# EAGLE design predajnik (EAGLE 7.5.0)
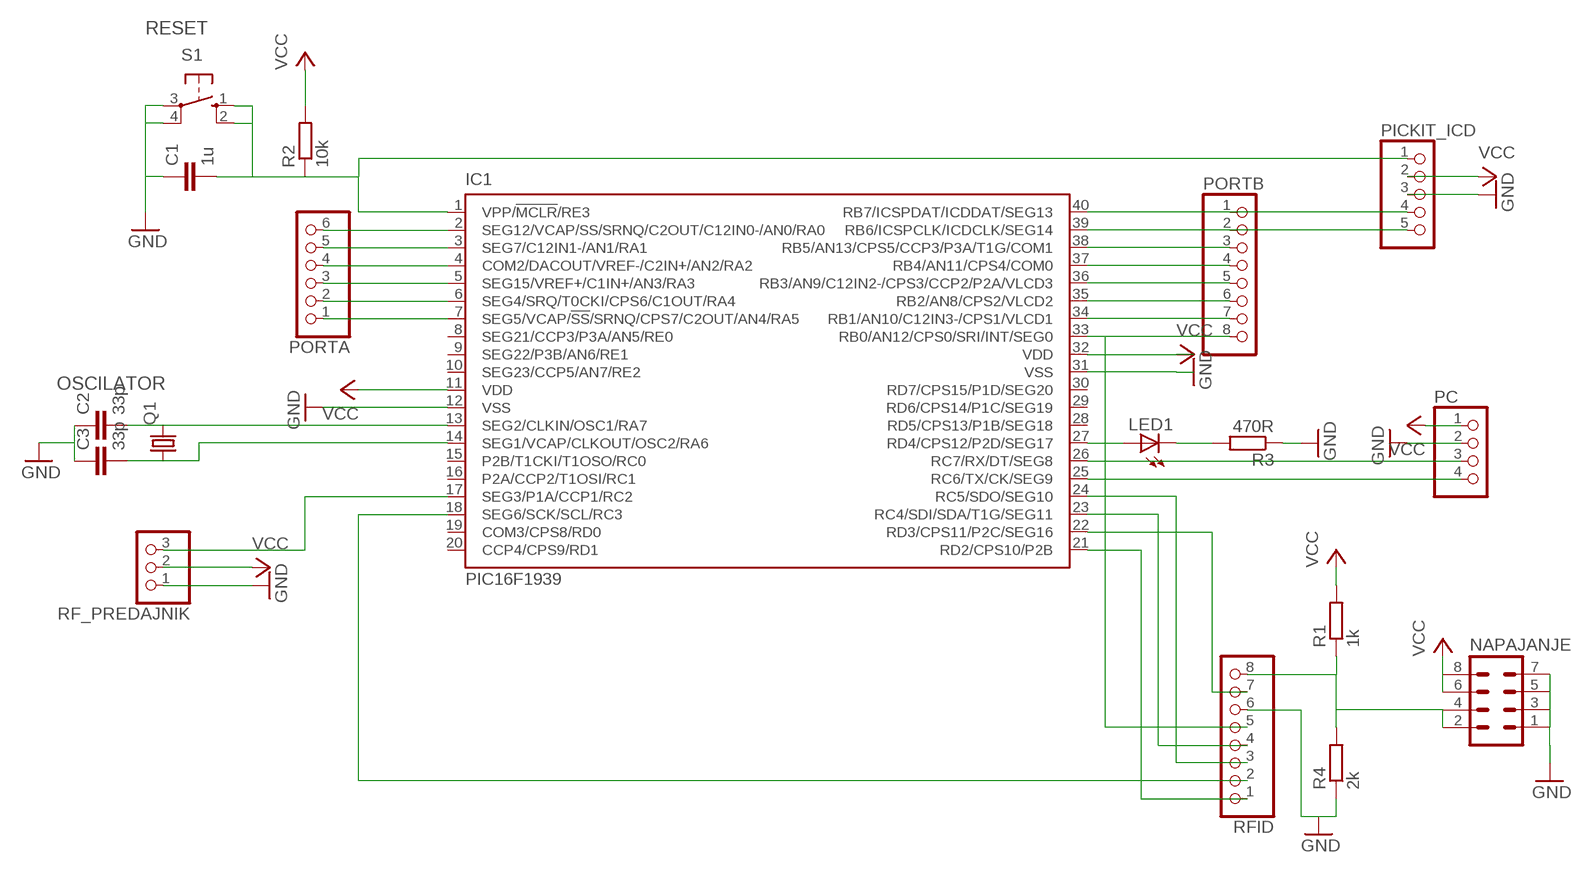
[diagram p0: schematic, sheet 1]

## Parts
C1  1u  C-EU050-024X044  [C050-024X044]
C2  33p  C-EU025-024X044  [C025-024X044]
C3  33p  C-EU025-024X044  [C025-024X044]
IC1  PIC16F1939  PIC16F193  [DIL40]
LED1  LED5MM  [LED5MM]
NAPAJANJE  MA04-2  [MA04-2]
PC  PINHD-1X4  [1X04]
PICKIT_ICD  PINHD-1X5  [1X05]
PORTA  PINHD-1X6  [1X06]
PORTB  PINHD-1X8  [1X08]
Q1  CRYSTALHC49S  [HC49/S]
R1  1k  R-EU_0207/10  [0207/10]
R2  10k  R-EU_0207/10  [0207/10]
R3  470R  R-EU_0207/10  [0207/10]
R4  2k  R-EU_0207/10  [0207/10]
RF_PREDAJNIK  PINHD-1X3  [1X03]
RFID  PINHD-1X8  [1X08]
S1  10-XX  [B3F-10XX]

## Nets
GND: C1.1 C2.1 C3.1 IC1.12(VSS) IC1.31(VSS) NAPAJANJE.1 NAPAJANJE.3 NAPAJANJE.5 NAPAJANJE.7 PC.2 PICKIT_ICD.3 R3.1 R4.1 RF_PREDAJNIK.1 RFID.6 S1.3(P) S1.4(P1)
N$1: IC1.22(RD3/CPS11/P2C/SEG16) RFID.7
N$2: IC1.17(SEG3/P1A/CCP1/RC2) RF_PREDAJNIK.3
N$3: C1.2 IC1.1(VPP/!MCLR!/RE3) PICKIT_ICD.1 R2.1 S1.1(S) S1.2(S1)
N$4: C3.2 IC1.14(SEG1/VCAP/CLKOUT/OSC2/RA6) Q1.1
N$5: C2.2 IC1.13(SEG2/CLKIN/OSC1/RA7) Q1.2
N$6: IC1.40(RB7/ICSPDAT/ICDDAT/SEG13) PICKIT_ICD.4 PORTB.1
N$7: IC1.39(RB6/ICSPCLK/ICDCLK/SEG14) PICKIT_ICD.5 PORTB.2
N$8: IC1.18(SEG6/SCK/SCL/RC3) RFID.2
N$9: IC1.24(RC5/SDO/SEG10) RFID.3
N$10: IC1.23(RC4/SDI/SDA/T1G/SEG11) RFID.4
N$11: IC1.33(RB0/AN12/CPS0/SRI/INT/SEG0) PORTB.8 RFID.5
N$13: IC1.21(RD2/CPS10/P2B) RFID.1
N$14: IC1.27(RD4/CPS12/P2D/SEG17) LED1.A
N$15: IC1.38(RB5/AN13/CPS5/CCP3/P3A/T1G/COM1) PORTB.3
N$16: IC1.7(SEG5/VCAP/!SS!/SRNQ/CPS7/C2OUT/AN4/RA5) PORTA.1
N$17: IC1.6(SEG4/SRQ/T0CKI/CPS6/C1OUT/RA4) PORTA.2
N$18: IC1.5(SEG15/VREF+/C1IN+/AN3/RA3) PORTA.3
N$19: IC1.4(COM2/DACOUT/VREF-/C2IN+/AN2/RA2) PORTA.4
N$20: IC1.3(SEG7/C12IN1-/AN1/RA1) PORTA.5
N$21: IC1.2(SEG12/VCAP/SS/SRNQ/C2OUT/C12IN0-/AN0/RA0) PORTA.6
N$22: IC1.37(RB4/AN11/CPS4/COM0) PORTB.4
N$23: IC1.36(RB3/AN9/C12IN2-/CPS3/CCP2/P2A/VLCD3) PORTB.5
N$24: IC1.35(RB2/AN8/CPS2/VLCD2) PORTB.6
N$25: IC1.34(RB1/AN10/C12IN3-/CPS1/VLCD1) PORTB.7
N$26: IC1.25(RC6/TX/CK/SEG9) PC.4
N$27: IC1.26(RC7/RX/DT/SEG8) PC.3
N$28: LED1.K(C) R3.2
N$45: NAPAJANJE.2 NAPAJANJE.4 R1.1 R4.2 RFID.8
VCC: IC1.11(VDD) IC1.32(VDD) NAPAJANJE.6 NAPAJANJE.8 PC.1 PICKIT_ICD.2 R1.2 R2.2 RF_PREDAJNIK.2
Unconnected: IC1.8(SEG21/CCP3/P3A/AN5/RE0) IC1.9(SEG22/P3B/AN6/RE1) IC1.10(SEG23/CCP5/AN7/RE2) IC1.15(P2B/T1CKI/T1OSO/RC0) IC1.16(P2A/CCP2/T1OSI/RC1) IC1.19(COM3/CPS8/RD0) IC1.20(CCP4/CPS9/RD1) IC1.28(RD5/CPS13/P1B/SEG18) IC1.29(RD6/CPS14/P1C/SEG19) IC1.30(RD7/CPS15/P1D/SEG20)

## Notes on the sheet
- RESET
- OSCILATOR

## Library data of the parts
C1-C3 = rcl:C-EU: CAPACITOR, European symbol
IC1 = microchip:PIC16F193*?: Flash-Based, 8-Bit CMOS Microcontrollers wtih LCD Driver and nanoWatt XLP Technology Auto generated by make-symbol-device-package-bsdl.ulp Rev. 33 Source: http://ww1.microchip.com/downloads/en/DeviceDoc/41364D.pdf
LED1 = led:LED: LED OSRAM: - CHIPLED LG R971, LG N971, LY N971, LG Q971, LY Q971, LO R971, LY R971 LH N974, LH R974 LS Q976, LO Q976, LY Q976 LO Q996 - Hyper CHIPLED LW Q18S LB Q993, LB Q99A, LB R99A - SideLED LS A670, LO A670, LY A670, LG A670, LP A670 LB A673, LV A673, LT A673, LW A673 LH A674 LY A675 LS A676, LA A676, LO A676, LY A676, LW A676 LS A679, LY A679, LG A679 - Hyper Micro SIDELED® LS Y876, LA Y876, LO Y876, LY Y876 LT Y87S - SmartLED LW L88C, LW L88S LB L89C, LB L89S, LG L890 LS L89K, LO L89K, LY L89K LS L896, LA L896, LO L896, LY L896 - TOPLED LS T670, LO T670, LY T670, LG T670, LP T670 LSG T670, LSP T670, LSY T670, LOP T670, LYG T670 LG T671, LOG T671, LSG T671 LB T673, LV T673, LT T673, LW T673 LH T674 LS T676, LA T676, LO T676, LY T676, LB T676, LH T676, LSB T676, LW T676 LB T67C, LV T67C, LT T67C, LS T67K, LO T67K, LY T67K, LW E67C LS E67B, LA E67B, LO E67B, LY E67B, LB E67C, LV E67C, LT E67C LW T67C LS T679, LY T679, LG T679 LS T770, LO T770, LY T770, LG T770, LP T770 LB T773, LV T773, LT T773, LW T773 LH T774 LS E675, LA E675, LY E675, LS T675 LS T776, LA T776, LO T776, LY T776, LB T776 LHGB T686 LT T68C, LB T68C - Hyper Mini TOPLED® LB M676 - Mini TOPLED Santana® LG M470 LS M47K, LO M47K, LY M47K Source: http://www.osram.convergy.de LUXEON: - LUMILED® LXK2-PW12-R00, LXK2-PW12-S00, LXK2-PW14-U00, LXK2-PW14-V00 LXK2-PM12-R00, LXK2-PM12-S00, LXK2-PM14-U00 LXK2-PE12-Q00, LXK2-PE12-R00, LXK2-PE12-S00, LXK2-PE14-T00, LXK2-PE14-U00 LXK2-PB12-K00, LXK2-PB12-L00, LXK2-PB12-M00, LXK2-PB14-N00, LXK2-PB14-P00, LXK2-PB14-Q00 LXK2-PR12-L00, LXK2-PR12-M00, LXK2-PR14-Q00, LXK2-PR14-R00 LXK2-PD12-Q00, LXK2-PD12-R00, LXK2-PD12-S00 LXK2-PH12-R00, LXK2-PH12-S00 LXK2-PL12-P00, LXK2-PL12-Q00, LXK2-PL12-R00 Source: www.luxeon.com KINGBRIGHT: KA-3528ASYC Source: www.kingbright.com
NAPAJANJE = con-lstb:MA04-2: PIN HEADER; OC_FARNELL: unknown; OC_NEWARK: unknown
PC = pinhead:PINHD-1X4: PIN HEADER
PICKIT_ICD = pinhead:PINHD-1X5: PIN HEADER
PORTA = pinhead:PINHD-1X6: PIN HEADER
PORTB RFID = pinhead:PINHD-1X8: PIN HEADER
Q1 = crystal:CRYSTAL: CRYSTAL; OC_FARNELL: 1667008; OC_NEWARK: unknown
R1-R4 = resistor:R-EU_: RESISTOR, European symbol
RF_PREDAJNIK = pinhead:PINHD-1X3: PIN HEADER
S1 = switch-omron:10-XX: OMRON SWITCH; MPN: B3F-1000; OC_FARNELL: 176432; OC_NEWARK: 36M3542

## Board
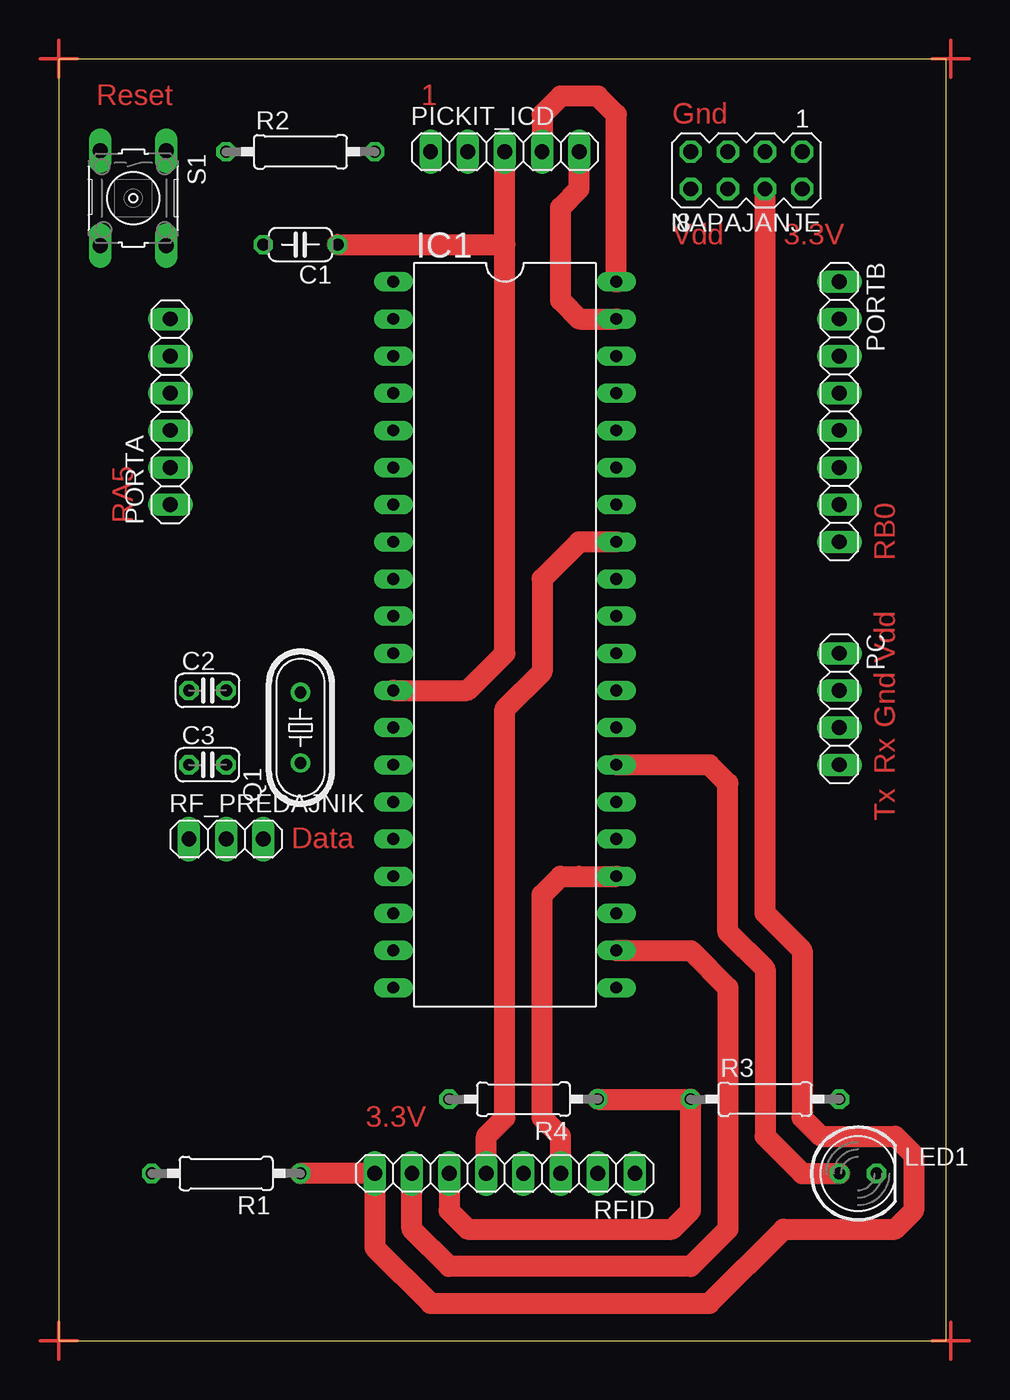
[diagram p1: board, top side]
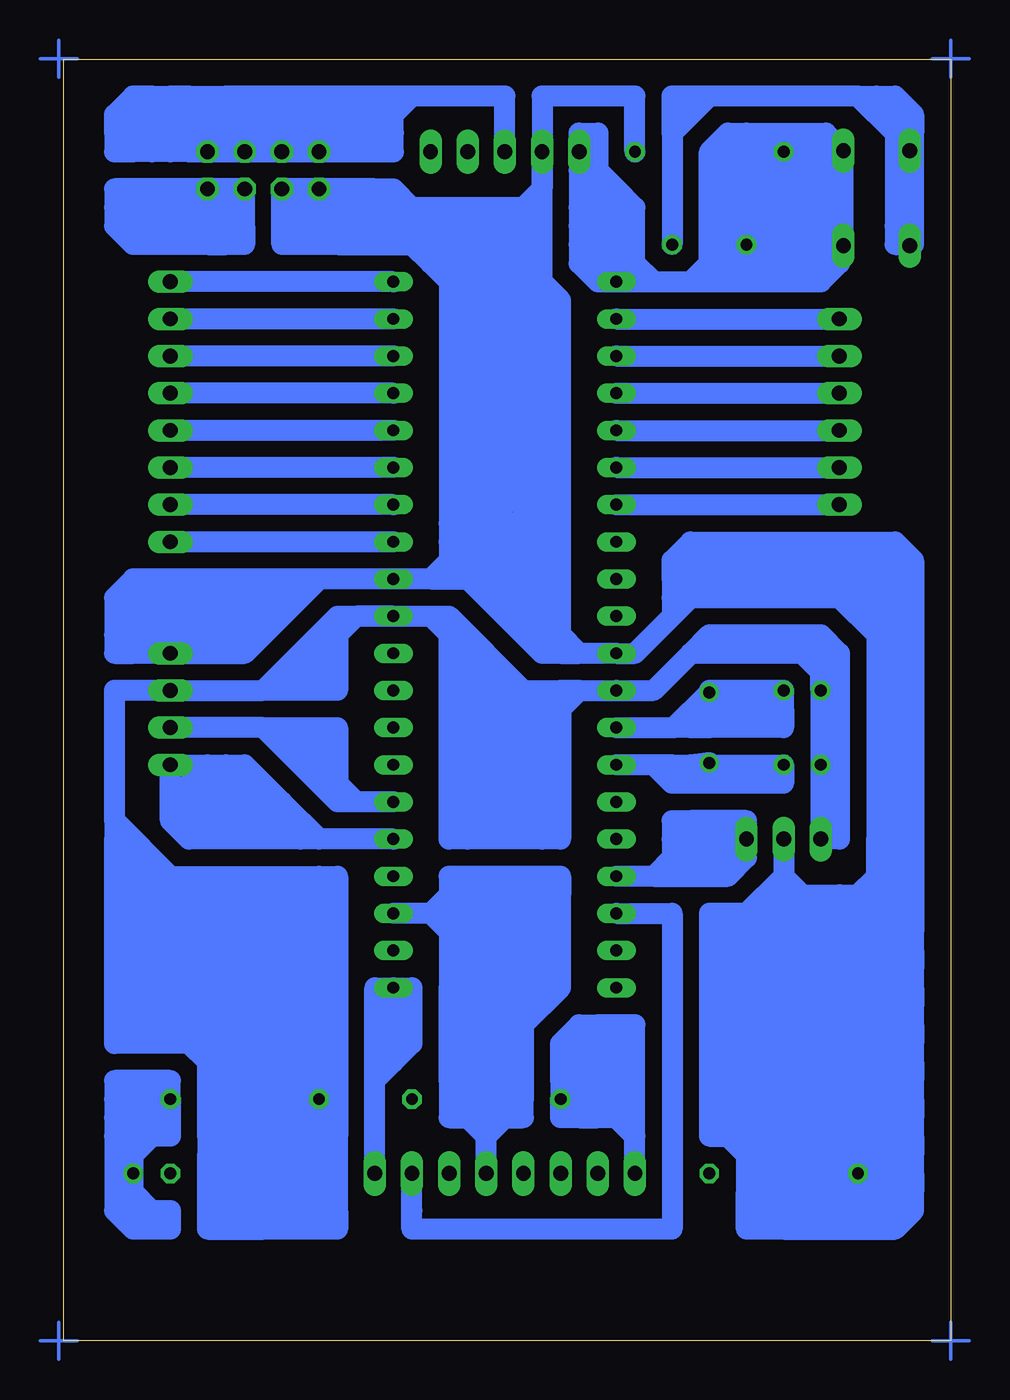
[diagram p2: board, bottom side, seen from below]

Size 60.63 x 87.62 mm. Coordinates in mm from the lower left corner, seen from the top.
Outline: 0,0 60.63,0 60.63,87.62 0,87.62 0,0
Copper layers (1*16): Top 0.035mm / dielectric 1.5mm / Bottom 0.035mm
Design rules "default": minimum track width 10mil, minimum drill 24mil, track to track 8mil, track to pad 8mil, pad to pad 8mil, via to via 8mil, smd to smd 8mil, copper to edge 40mil, drill to drill 8mil, minimum pad ring 10mil, minimum via ring 8mil, stop-mask expansion 4mil, vias tented up to drill 0mil, thermal gap 10mil

### Footprints (pad centres in the part's own frame; a part is rotated, then mirrored left to right if it is on the bottom)
C050-024X044 = drill 0.813 octagon: 1 -2.54,0; 2 2.54,0
C025-024X044 = drill 0.813 octagon: 1 -1.27,0; 2 1.27,0
DIL40 = drill 0.813 long: 1 -24.13,-7.62; 2 -21.59,-7.62; 3 -19.05,-7.62; 4 -16.51,-7.62; 5 -13.97,-7.62; 6 -11.43,-7.62; 7 -8.89,-7.62; 8 -6.35,-7.62; 9 -3.81,-7.62; 10 -1.27,-7.62; 11 1.27,-7.62; 12 3.81,-7.62; 13 6.35,-7.62; 14 8.89,-7.62; 15 11.43,-7.62; 16 13.97,-7.62; 17 16.51,-7.62; 18 19.05,-7.62; 19 21.59,-7.62; 20 24.13,-7.62; 21 24.13,7.62; 22 21.59,7.62; 23 19.05,7.62; 24 16.51,7.62; 25 13.97,7.62; 26 11.43,7.62; 27 8.89,7.62; 28 6.35,7.62; 29 3.81,7.62; 30 1.27,7.62; 31 -1.27,7.62; 32 -3.81,7.62; 33 -6.35,7.62; 34 -8.89,7.62; 35 -11.43,7.62; 36 -13.97,7.62; 37 -16.51,7.62; 38 -19.05,7.62; 39 -21.59,7.62; 40 -24.13,7.62
LED5MM = drill 0.813 octagon: A -1.27,0; K 1.27,0
MA04-2 = drill 1.016 octagon: 1 -3.81,-1.27; 2 -3.81,1.27; 3 -1.27,-1.27; 4 -1.27,1.27; 5 1.27,-1.27; 6 1.27,1.27; 7 3.81,-1.27; 8 3.81,1.27
1X04 = drill 1.016 long: 1 -3.81,0; 2 -1.27,0; 3 1.27,0; 4 3.81,0
1X05 = drill 1.016 long: 1 -5.08,0; 2 -2.54,0; 3 0,0; 4 2.54,0; 5 5.08,0
1X06 = drill 1.016 long: 1 -6.35,0; 2 -3.81,0; 3 -1.27,0; 4 1.27,0; 5 3.81,0; 6 6.35,0
1X08 = drill 1.016 long: 1 -8.89,0; 2 -6.35,0; 3 -3.81,0; 4 -1.27,0; 5 1.27,0; 6 3.81,0; 7 6.35,0; 8 8.89,0
HC49/S = drill 0.813: 1 -2.413,0; 2 2.413,0
0207/10 = drill 0.813 octagon: 1 -5.08,0; 2 5.08,0
1X03 = drill 1.016 long: 1 -2.54,0; 2 0,0; 3 2.54,0
B3F-10XX = drill 1.016 long: 1 -3.251,2.261; 2 3.251,2.261; 3 -3.251,-2.261; 4 3.251,-2.261

### Placement (x,y rotation side)
C1  16.51,74.93 180 top
C2  10.16,44.45 0 top
C3  10.16,39.37 0 top
IC1  30.48,48.26 270 top
LED1  54.61,11.43 0 top
NAPAJANJE  46.99,80.01 180 top
PC  53.34,43.18 270 top
PICKIT_ICD  30.48,81.28 0 top
PORTA  7.62,63.5 90 top
PORTB  53.34,63.5 270 top
Q1  16.51,41.91 90 top
R1  11.43,11.43 180 top
R2  16.51,81.28 0 top
R3  48.26,16.51 0 top
R4  31.75,16.51 180 top
RF_PREDAJNIK  11.43,34.29 0 top
RFID  30.48,11.43 180 top
S1  5.08,78.11 270 top

### Tracks (layer width: path | path; a pad name or v marks a point on that pad's centre or on a via)
GND
  Top 1.422: IC1.12 27.94,44.45 30.48,46.99 30.48,74.93 | 30.48,74.93 PICKIT_ICD.3 | RFID.6 26.67,8.89 27.94,7.62 41.91,7.62 43.18,8.89 R3.1 R4.1 | C1.1 30.48,74.93
  Bottom 1.422: S1.3 S1.4 2.9,74.93 | 2.9,74.93 2.9,75.29 3.81,76.2 | 6.35,85.09 16.51,85.09 | 2.54,74.93 2.54,81.28 | 2.54,81.28 3.81,82.55 | 3.81,82.55 6.35,85.09 | 16.51,85.09 19.05,82.55 | 19.05,82.55 C1.1 | PICKIT_ICD.3 30.48,85.09 36.83,85.09 | 38.1,85.09 41.91,85.09 | 43.18,83.82 43.18,85.09 | 43.18,85.09 48.26,85.09 | 48.26,85.09 49.53,85.09 | 49.53,85.09 50.8,83.82 | NAPAJANJE.1 49.53,81.28 | NAPAJANJE.5 NAPAJANJE.7 | NAPAJANJE.7 44.45,82.55 | 44.45,82.55 44.45,83.82 | 44.45,83.82 43.18,83.82 | 44.45,83.82 49.53,83.82 49.53,82.55 | 49.53,82.55 49.53,81.28 | 49.53,81.28 NAPAJANJE.3 | NAPAJANJE.5 44.45,82.55 | 44.45,82.55 49.53,82.55 | 49.53,82.55 NAPAJANJE.3 | NAPAJANJE.3 NAPAJANJE.5 | 43.18,83.82 43.18,82.55 | 43.18,82.55 NAPAJANJE.7 | NAPAJANJE.7 39.37,81.28 | 38.1,83.82 36.83,85.09 | 36.83,85.09 38.1,85.09 | 38.1,85.09 39.37,83.82 | 39.37,83.82 39.37,82.55 43.18,82.55 | 43.18,82.55 41.91,83.82 | 41.91,83.82 39.37,83.82 | 41.91,83.82 43.18,83.82 | 43.18,83.82 41.91,85.09 | 41.91,85.09 43.18,85.09 | R3.1 44.45,17.78 | 49.53,17.78 50.8,19.05 | IC1.31 40.64,49.53 41.91,48.26 | 43.18,44.45 44.45,44.45 | 43.18,44.45 41.91,45.72 41.91,46.99 | 41.91,46.99 44.45,44.45 | 44.45,44.45 45.72,44.45 | 45.72,44.45 46.99,44.45 | 46.99,44.45 45.72,45.72 | 45.72,45.72 44.45,46.99 | 41.91,48.26 41.91,46.99 | 41.91,46.99 43.18,46.99 | 44.45,45.72 45.72,45.72 | 45.72,45.72 45.72,44.45 | 43.18,46.99 41.91,48.26 | 41.91,48.26 43.18,48.26 | 43.18,48.26 41.91,49.53 | IC1.31 35.56,49.53 | 35.56,49.53 34.29,49.53 29.21,44.45 | 41.91,49.53 41.91,44.45 43.18,44.45 | 44.45,44.45 44.45,45.72 | 45.72,44.45 43.18,46.99 | 57.15,35.56 53.34,31.75 | 53.34,31.75 43.18,31.75 | 43.18,31.75 41.91,31.75 41.91,30.48
  Bottom 1.422: 41.91,19.05 R3.1 | 41.91,17.78 41.91,13.97 | 43.18,7.62 41.91,7.62 41.91,8.89 | 43.18,7.62 46.99,7.62 | 46.99,7.62 48.26,8.89 | 50.8,15.24 50.8,16.51 | 50.8,16.51 50.8,19.05 | 50.8,19.05 52.07,20.32 57.15,20.32 | 57.15,20.32 57.15,21.59 | 57.15,21.59 57.15,34.29 | 57.15,35.56 57.15,34.29 | 55.88,33.02 54.61,31.75 | 54.61,31.75 53.34,31.75 | 43.18,31.75 41.91,30.48 | 41.91,30.48 41.91,17.78 | 41.91,17.78 R3.1 | R3.1 43.18,15.24 | 43.18,15.24 43.18,12.7 | 46.99,8.89 48.26,8.89 | 48.26,11.43 46.99,12.7 | 46.99,11.43 46.99,10.16 | 44.45,16.51 44.45,17.78 | 44.45,17.78 45.72,17.78 | 45.72,17.78 44.45,16.51 | 44.45,16.51 44.45,13.97 | 44.45,13.97 44.45,11.43 | 45.72,10.16 45.72,12.7 | 45.72,16.51 45.72,17.78 | 48.26,17.78 49.53,17.78 | 49.53,17.78 50.8,16.51 | 50.8,16.51 49.53,16.51 | 49.53,16.51 46.99,16.51 | 46.99,16.51 45.72,16.51 | 45.72,16.51 45.72,15.24 | 45.72,15.24 45.72,12.7 | 45.72,12.7 46.99,11.43 | 46.99,12.7 46.99,13.97 | 46.99,16.51 46.99,15.24 | 46.99,15.24 46.99,13.97 | 46.99,13.97 48.26,12.7 | 48.26,12.7 48.26,13.97 | 48.26,13.97 48.26,15.24 | 48.26,15.24 46.99,15.24 | 46.99,15.24 45.72,15.24 | 49.53,15.24 48.26,13.97 | 48.26,13.97 46.99,15.24 | 46.99,15.24 43.18,19.05 43.18,30.48 44.45,30.48 | 54.61,30.48 55.88,31.75 | 55.88,31.75 55.88,33.02 | 55.88,31.75 55.88,21.59 | 55.88,21.59 54.61,21.59 | 54.61,21.59 52.07,21.59 | 52.07,21.59 48.26,17.78 | 48.26,17.78 45.72,17.78 | 45.72,17.78 44.45,19.05 | 44.45,27.94 44.45,29.21 | 44.45,29.21 44.45,30.48 | 44.45,30.48 45.72,30.48 | 45.72,30.48 54.61,30.48 | 54.61,30.48 54.61,24.13 | 54.61,24.13 54.61,22.86 | 54.61,21.59 54.61,22.86 | 54.61,22.86 52.07,22.86 | 52.07,22.86 50.8,22.86 | 50.8,22.86 50.8,21.59 | 50.8,21.59 48.26,19.05 45.72,19.05
  Bottom 1.422: 45.72,26.67 45.72,29.21 | 45.72,29.21 46.99,29.21 | 46.99,29.21 48.26,29.21 | 52.07,29.21 53.34,29.21 | 53.34,29.21 53.34,27.94 | 53.34,27.94 53.34,24.13 50.8,24.13 | 50.8,24.13 50.8,22.86 | 50.8,22.86 49.53,21.59 | 49.53,21.59 48.26,20.32 46.99,20.32 | 46.99,20.32 45.72,19.05 | 45.72,19.05 45.72,26.67 | 45.72,26.67 46.99,27.94 | 46.99,27.94 46.99,25.4 | 46.99,25.4 46.99,22.86 | 46.99,22.86 46.99,20.32 | 46.99,20.32 48.26,21.59 48.26,26.67 | 48.26,27.94 48.26,29.21 | 52.07,29.21 53.34,27.94 | 53.34,27.94 52.07,27.94 | 52.07,27.94 50.8,27.94 | 50.8,27.94 49.53,27.94 | 49.53,27.94 48.26,27.94 | 48.26,27.94 48.26,26.67 | 48.26,26.67 49.53,27.94 | 49.53,27.94 49.53,26.67 | 49.53,21.59 49.53,26.67 | 49.53,26.67 50.8,27.94 | 50.8,27.94 50.8,26.67 | 50.8,24.13 50.8,26.67 | 50.8,26.67 52.07,27.94 | 52.07,27.94 52.07,24.13 | 52.07,22.86 52.07,24.13 | 52.07,24.13 46.99,29.21 | 46.99,29.21 46.99,27.94 | 46.99,25.4 44.45,27.94 | 44.45,27.94 44.45,19.05 | 44.45,19.05 R3.1 | 25.4,44.45 26.67,43.18 26.67,34.29 27.94,34.29 | 27.94,34.29 33.02,34.29 | 34.29,35.56 34.29,48.26 | 29.21,44.45 26.67,44.45 | 25.4,44.45 26.67,44.45 | 27.94,39.37 27.94,38.1 | 27.94,36.83 27.94,35.56 | 27.94,35.56 29.21,35.56 | 29.21,35.56 30.48,35.56 | 33.02,35.56 33.02,46.99 | 33.02,46.99 34.29,48.26 | 30.48,44.45 29.21,44.45 | 29.21,44.45 27.94,43.18 | 27.94,43.18 27.94,41.91 | 29.21,36.83 31.75,36.83 | 31.75,43.18 31.75,45.72 | 30.48,44.45 29.21,43.18 | 29.21,43.18 29.21,40.64 | 29.21,39.37 29.21,38.1 | 29.21,38.1 30.48,38.1 31.75,36.83 | 31.75,36.83 31.75,38.1 | 31.75,38.1 31.75,43.18 | 31.75,43.18 30.48,44.45 | 30.48,44.45 30.48,39.37 | 30.48,39.37 31.75,38.1 | 30.48,39.37 29.21,40.64 | 29.21,40.64 29.21,39.37
  Bottom 1.422: 29.21,39.37 33.02,35.56 | 33.02,35.56 30.48,35.56 | 30.48,35.56 29.21,36.83 | 29.21,38.1 27.94,39.37 | 27.94,39.37 27.94,41.91 | 27.94,41.91 29.21,43.18 | 31.75,45.72 33.02,46.99 | 29.21,43.18 27.94,43.18 | 27.94,43.18 26.67,44.45 | 25.4,44.45 IC1.12 20.32,44.45 17.78,46.99 | 33.02,34.29 34.29,34.29 34.29,35.56 | 34.29,35.56 33.02,34.29 | 27.94,35.56 27.94,34.29 | 27.94,34.29 29.21,35.56 | 29.21,35.56 29.21,36.83 | 27.94,38.1 27.94,36.83 | 27.94,36.83 29.21,35.56 | 29.21,36.83 29.21,38.1 | 38.1,82.55 38.1,81.28 39.37,81.28 | 38.1,82.55 39.37,81.28 | 38.1,82.55 38.1,83.82 | 38.1,83.82 39.37,83.82 | 29.21,36.83 27.94,38.1 | 27.94,38.1 29.21,38.1 | 3.81,82.55 3.81,74.93 2.9,74.93 | 6.35,85.09 5.08,85.09 | 5.08,85.09 3.81,85.09 | 3.81,85.09 2.54,83.82 2.54,82.55 | 2.54,81.28 2.54,82.55 | 2.54,82.55 3.81,83.82 | 5.08,85.09 3.81,83.82 | 3.81,85.09 3.81,83.82 | 43.18,8.89 44.45,10.16 | 44.45,10.16 45.72,10.16 | 45.72,10.16 46.99,10.16 | 46.99,10.16 46.99,8.89 | 46.99,11.43 46.99,12.7 | 48.26,15.24 49.53,15.24 | 49.53,15.24 50.8,13.97 | 50.8,13.97 50.8,15.24 | 50.8,15.24 49.53,16.51 | 49.53,16.51 49.53,20.32 46.99,22.86 | 46.99,22.86 50.8,22.86 | 52.07,22.86 50.8,21.59 | 50.8,21.59 52.07,21.59 | 52.07,21.59 54.61,24.13 | 54.61,24.13 52.07,24.13 | 46.99,29.21 45.72,30.48 | 45.72,30.48 44.45,29.21 | 44.45,29.21 45.72,29.21 | 48.26,29.21 52.07,29.21 | 53.34,29.21 54.61,30.48 | 54.61,30.48 54.61,31.75 | 55.88,33.02 57.15,34.29 | 57.15,35.56 57.15,44.45 PC.2 46.99,44.45 | 44.45,45.72 44.45,46.99 | 44.45,46.99 43.18,48.26 | 41.91,49.53 IC1.31 | 35.56,49.53 34.29,48.26 | 31.75,45.72 30.48,44.45 | 44.45,10.16 44.45,11.43 | 44.45,11.43 45.72,12.7 | 52.07,81.28 53.34,81.28 | 57.15,82.55 57.15,83.82 55.88,85.09
  Bottom 1.422: 54.61,85.09 53.34,85.09 | 52.07,85.09 49.53,85.09 | 48.26,85.09 50.8,82.55 | 50.8,82.55 50.8,83.82 | 50.8,83.82 52.07,85.09 | 52.07,81.28 NAPAJANJE.1 | NAPAJANJE.1 49.53,82.55 | 49.53,82.55 50.8,82.55 | 50.8,82.55 52.07,81.28 | 52.07,81.28 52.07,85.09 | 52.07,85.09 53.34,85.09 | 53.34,85.09 53.34,81.28 | 53.34,81.28 54.61,81.28 | 54.61,81.28 54.61,85.09 | 54.61,85.09 55.88,85.09 | 55.88,85.09 55.88,81.28 | 57.15,82.55 50.8,82.55 | 44.45,82.55 43.18,82.55 | 48.26,12.7 49.53,13.97 | 49.53,13.97 50.8,13.97 | 50.8,13.97 50.8,12.7 | 50.8,12.7 49.53,13.97 | 49.53,13.97 49.53,8.89 | 48.26,8.89 48.26,11.43 | 48.26,11.43 48.26,12.7 | 48.26,8.89 48.26,7.62 | 48.26,7.62 46.99,7.62 | 49.53,8.89 48.26,8.89 | 48.26,7.62 46.99,8.89 | 46.99,8.89 43.18,8.89 | 43.18,8.89 43.18,12.7 | 43.18,12.7 44.45,13.97 | 17.78,46.99 16.51,48.26 10.16,48.26 | C2.1 8.89,43.13 | 10.16,48.26 8.89,48.26 | 8.89,48.26 7.62,46.99 7.62,34.29 RF_PREDAJNIK.1 C3.1 C2.1 | C2.1 8.89,45.72 | 10.16,48.26 8.89,46.99 8.89,45.72 | 8.89,45.72 10.16,46.99 17.78,46.99 | 8.89,48.26 C2.1 | 50.8,7.62 50.8,12.7 | 50.8,7.62 48.26,7.62 | 48.26,7.62 49.53,8.89 | 50.8,7.62 49.53,8.89 | 57.15,82.55 57.15,81.28 55.88,81.28 | 54.61,81.28 55.88,81.28 | 57.15,21.59 55.88,21.59 | 57.15,20.32 55.88,21.59 | 43.18,7.62 41.91,8.89 | 41.91,8.89 41.91,13.97 | 41.91,13.97 43.18,15.24 | 16.51,85.09 17.78,85.09 | 17.78,85.09 19.05,85.09 19.05,83.82 | 19.05,82.55 19.05,83.82 | 17.78,85.09 19.05,83.82
N$1
  Top 1.422: IC1.22 43.18,26.67 45.72,24.13 45.72,7.62 43.18,5.08 26.67,5.08 24.13,7.62 RFID.7
N$2
  Bottom 1.422: 13.97,33.02 RF_PREDAJNIK.3 | RF_PREDAJNIK.3 13.97,35.56 17.78,35.56 | 17.78,35.56 19.05,34.29 | 19.05,34.29 RF_PREDAJNIK.3 | 20.32,31.75 19.05,31.75 | 19.05,31.75 15.24,31.75 13.97,33.02 | 19.05,33.02 13.97,33.02 | 19.05,31.75 19.05,33.02 | 19.05,34.29 19.05,35.56 17.78,35.56 | 19.05,34.29 19.05,33.02 | 19.05,33.02 20.32,31.75 | 20.32,31.75 IC1.17
N$3
  Bottom 1.422: 20.32,72.39 17.78,72.39 | 16.51,72.39 8.89,72.39 | 7.62,73.66 7.62,74.57 | 7.62,74.57 S1.2 S1.1 8.53,82.55 | C1.2 15.24,74.93 | 16.51,76.2 16.51,77.47 | 16.51,80.01 16.51,81.28 15.24,82.55 13.97,82.55 | 13.97,82.55 8.53,82.55 | 8.53,82.55 8.53,78.38 7.62,77.47 | 7.62,77.47 7.62,76.2 | 7.62,73.66 8.89,72.39 | 8.89,72.39 7.62,76.2 | 7.62,77.47 7.62,78.74 | 7.62,76.2 7.62,74.57 | 7.62,73.66 13.97,73.66 | 16.51,73.66 17.78,72.39 | 17.78,72.39 16.51,72.39 | 16.51,72.39 15.24,73.66 | 15.24,73.66 16.51,73.66 | 16.51,73.66 16.51,74.93 | 16.51,74.93 16.51,76.2 | 16.51,76.2 15.24,74.93 | 15.24,74.93 16.51,74.93 | 16.51,74.93 15.24,73.66 | 15.24,73.66 13.97,73.66 | 13.97,73.66 12.7,74.93 C1.2 | C1.2 8.89,74.93 8.89,76.2 | 8.89,76.2 7.62,77.47 | 7.62,77.47 15.24,77.47 15.24,76.2 11.43,76.2 | 11.43,76.2 8.89,76.2 | 8.89,76.2 8.89,78.74 10.16,78.74 | 13.97,78.74 15.24,78.74 | 15.24,78.74 16.51,77.47 | 16.51,77.47 16.51,80.01 | 16.51,80.01 15.24,81.28 | 15.24,81.28 15.24,80.01 | 15.24,78.74 15.24,80.01 | 15.24,80.01 13.97,81.28 | 13.97,80.01 13.97,78.74 | 13.97,78.74 12.7,78.74 | 12.7,78.74 10.16,78.74 | 10.16,78.74 8.89,80.01 8.89,81.28 | 12.7,81.28 13.97,81.28 | 13.97,81.28 13.97,80.01 | 13.97,80.01 10.16,80.01 8.89,81.28 | 8.89,81.28 R2.1 | R2.1 12.7,81.28 | 12.7,81.28 13.97,82.55 | 13.97,82.55 15.24,81.28 | 15.24,81.28 12.7,78.74 | 12.7,78.74 12.7,77.47 11.43,76.2 | 11.43,76.2 R2.1 | IC1.1 21.59,72.39 | 21.59,72.39 20.32,72.39 | 20.32,72.39 21.59,73.66 | 21.59,73.66 21.59,77.47 22.86,78.74 | 24.13,78.74 22.86,78.74 | 22.86,78.74 24.13,80.01 | 24.13,80.01 24.13,82.55 25.4,82.55 PICKIT_ICD.1 25.4,80.01 | 25.4,80.01 25.4,77.47 | 25.4,76.2 25.4,74.93 | 25.4,74.93 25.4,73.66 24.13,72.39 IC1.1
  Bottom 1.422: 21.59,72.39 21.59,73.66 | 21.59,73.66 22.86,74.93 | 22.86,74.93 IC1.1 | IC1.1 24.13,73.66 | 24.13,73.66 22.86,74.93 | 22.86,74.93 22.86,77.47 24.13,77.47 | 24.13,77.47 25.4,77.47 | 25.4,77.47 25.4,76.2 | 25.4,76.2 24.13,74.93 | 24.13,74.93 24.13,76.2 | 24.13,74.93 24.13,73.66 | 24.13,73.66 25.4,74.93 | 25.4,74.93 24.13,76.2 | 24.13,76.2 24.13,77.47 | 24.13,77.47 24.13,80.01 | 24.13,80.01 25.4,80.01
N$4
  Bottom 1.422: Q1.1 16.64,39.5 17.78,39.37 | 17.78,39.37 16.51,39.37 | 16.51,39.37 16.51,38.1 | 16.51,38.1 11.43,38.1 C3.2 16.51,39.37 | 16.51,38.1 17.78,38.1 | 17.78,38.1 17.78,39.37 | 20.32,39.37 IC1.14 | 17.78,38.1 19.05,38.1 | 19.05,38.1 20.32,39.37 | 17.78,39.37 19.05,38.1 | 19.05,38.1 19.05,39.37 | 19.05,39.37 20.32,39.37 | 19.05,39.37 17.78,39.37
N$5
  Bottom 1.422: 11.56,44.32 C2.2 | IC1.13 18.92,41.91 | 18.92,41.91 Q1.2 | Q1.2 16.51,43.18 | 16.51,43.18 17.78,41.91 | 17.78,41.91 18.92,41.91 | 17.78,41.91 16.51,41.91 | 11.43,43.18 C2.2 | C2.2 16.51,44.45 Q1.2 | 15.24,43.18 11.43,43.18 | 11.43,43.18 11.43,41.91 16.51,41.91 | 16.51,41.91 16.51,43.18 | 16.51,43.18 15.24,43.18 | 15.24,43.18 15.24,44.45 C2.2
N$6
  Top 1.422: IC1.40 38.1,83.82 36.83,85.09 34.29,85.09 33.02,83.82 PICKIT_ICD.4
  Bottom 1.422: IC1.40 PORTB.1
N$7
  Top 1.422: IC1.39 35.56,69.85 34.29,71.12 34.29,77.47 35.56,78.74 PICKIT_ICD.5
  Bottom 1.422: IC1.39 PORTB.2
N$8
  Bottom 1.422: 36.83,8.89 RFID.2 36.83,7.62 19.05,7.62 19.05,29.21 IC1.18
N$9
  Top 1.422: 35.56,31.75 IC1.24 34.29,31.75 33.02,30.48 33.02,15.24 34.29,13.97 RFID.3
N$10
  Bottom 1.422: 34.29,31.75 33.02,30.48 | RFID.4 31.75,13.97 | 31.75,13.97 30.48,15.24 | 30.48,15.24 29.21,15.24 29.21,16.51 | 26.67,30.48 26.67,24.13 29.21,21.59 29.21,16.51 | 27.94,31.75 26.67,31.75 26.67,30.48 | 27.94,31.75 34.29,31.75 | 29.21,16.51 30.48,15.24 | 30.48,15.24 31.75,15.24 | 31.75,17.78 31.75,21.59 | 31.75,25.4 31.75,29.21 33.02,30.48 | 33.02,30.48 31.75,30.48 | 30.48,30.48 27.94,30.48 | 27.94,29.21 27.94,24.13 29.21,22.86 | 29.21,22.86 30.48,21.59 | 30.48,21.59 30.48,19.05 | 30.48,19.05 30.48,16.51 31.75,15.24 | 31.75,15.24 31.75,17.78 | 31.75,17.78 30.48,19.05 | 30.48,21.59 30.48,22.86 | 30.48,27.94 30.48,29.21 | 30.48,29.21 31.75,30.48 | 31.75,30.48 30.48,30.48 | 30.48,30.48 29.21,29.21 29.21,27.94 | 29.21,22.86 29.21,24.13 | 29.21,24.13 29.21,27.94 | 29.21,27.94 30.48,29.21 | 31.75,30.48 31.75,26.67 29.21,24.13 | 27.94,31.75 26.67,30.48 | 34.29,31.75 34.29,30.48 | 34.29,30.48 34.29,29.21 | 34.29,29.21 34.29,27.94 | 34.29,27.94 34.29,24.13 | 34.29,17.78 34.29,15.24 33.02,15.24 | 33.02,15.24 31.75,13.97 | 31.75,13.97 31.75,15.24 | 31.75,15.24 33.02,15.24 | 33.02,15.24 33.02,19.05 | 33.02,24.13 33.02,20.32 | 33.02,20.32 33.02,19.05 | 33.02,19.05 34.29,17.78 | 34.29,17.78 34.29,19.05 | 34.29,22.86 33.02,24.13 | 33.02,27.94 33.02,30.48 | 33.02,19.05 34.29,19.05 | 34.29,19.05 34.29,20.32 34.29,21.59 34.29,22.86 | 34.29,22.86 34.29,24.13 | 34.29,24.13 31.75,24.13 30.48,22.86 | 30.48,22.86 30.48,27.94 | 30.48,27.94 27.94,30.48 | 27.94,30.48 27.94,29.21 | 27.94,29.21 31.75,25.4 | 31.75,25.4 31.75,21.59 | 31.75,21.59 33.02,20.32 | 33.02,24.13 33.02,27.94 | 33.02,27.94 34.29,29.21 | 34.29,29.21 35.56,29.21 | 34.29,30.48 35.56,29.21 | 34.29,27.94 35.56,29.21
  Bottom 1.422: 35.56,29.21 IC1.23
N$11
  Top 1.422: IC1.33 35.56,54.61 33.02,52.07 33.02,45.72 30.48,43.18 30.48,15.24 29.21,13.97 RFID.5
  Bottom 1.422: IC1.33 PORTB.8
N$13
  Bottom 1.422: RFID.1 39.37,17.78 | IC1.21 36.83,24.13 36.83,20.32 38.1,19.05 | 38.1,19.05 39.37,17.78 | 39.37,17.78 39.37,20.32 | IC1.21 39.37,24.13 39.37,22.86 39.37,20.32 | IC1.21 38.1,19.05 | 38.1,19.05 39.37,20.32
N$14
  Top 1.422: IC1.27 44.45,39.37 45.72,38.1 45.72,27.94 48.26,25.4 48.26,13.97 50.8,11.43 LED1.A
N$15
  Bottom 1.422: IC1.38 PORTB.3
N$16
  Bottom 1.422: IC1.7 PORTA.1
N$17
  Bottom 1.422: IC1.6 PORTA.2
N$18
  Bottom 1.422: IC1.5 PORTA.3
N$19
  Bottom 1.422: IC1.4 PORTA.4
N$20
  Bottom 1.422: IC1.3 PORTA.5
N$21
  Bottom 1.422: IC1.2 PORTA.6
N$22
  Bottom 1.422: IC1.37 PORTB.4
N$23
  Bottom 1.422: IC1.36 PORTB.5
N$24
  Bottom 1.422: IC1.35 PORTB.6
N$25
  Bottom 1.422: IC1.34 PORTB.7
N$26
  Bottom 1.422: IC1.25 43.18,34.29 | 44.45,34.29 52.07,34.29 53.34,35.56 PC.4 50.8,39.37 | 49.53,39.37 48.26,39.37 | 48.26,39.37 45.72,36.83 | 45.72,36.83 43.18,34.29 | 43.18,34.29 44.45,34.29 | 44.45,34.29 45.72,35.56 48.26,35.56 | 52.07,35.56 52.07,38.1 | 50.8,38.1 50.8,36.83 | 45.72,36.83 46.99,36.83 | 50.8,36.83 52.07,35.56 | 52.07,35.56 48.26,35.56 | 48.26,35.56 48.26,36.83 | 49.53,38.1 50.8,39.37 | 50.8,39.37 49.53,39.37 | 49.53,39.37 46.99,36.83 | 46.99,36.83 48.26,36.83 | 48.26,36.83 49.53,36.83 | 49.53,36.83 50.8,38.1 | 50.8,38.1 49.53,38.1 | 49.53,38.1 48.26,36.83 | 49.53,36.83 50.8,36.83 | 50.8,36.83 52.07,38.1 | 52.07,38.1 50.8,38.1 | 49.53,38.1 48.26,39.37
N$27
  Bottom 1.422: IC1.26 40.64,36.83 | 46.99,41.91 PC.3 | 41.91,40.64 41.91,39.37 | 41.91,39.37 43.18,39.37 | 43.18,39.37 44.45,40.64 | 44.45,40.64 45.72,40.64 | 45.72,40.64 46.99,41.91 | 46.99,41.91 45.72,41.91 | 45.72,41.91 44.45,40.64 | 43.18,39.37 41.91,38.1 | 41.91,39.37 41.91,38.1 | 41.91,38.1 40.64,36.83 | 40.64,36.83 41.91,36.83 43.18,38.1 | 43.18,38.1 45.72,40.64 | 44.45,40.64 41.91,40.64 | 41.91,40.64 43.18,39.37 | 43.18,39.37 43.18,38.1 | 45.72,41.91 43.18,41.91 | 43.18,41.91 41.91,41.91 41.91,40.64 | 41.91,40.64 43.18,41.91
N$28
  Bottom 1.422: R3.2 53.34,17.78 54.61,17.78 | R3.2 53.34,13.97 54.61,13.97 | 54.61,13.97 55.88,12.7 | 55.88,12.7 LED1.K 55.88,10.16 | 55.88,15.24 55.88,16.51 | 55.88,16.51 54.61,17.78 | 54.61,17.78 R3.2 | R3.2 53.34,15.24 54.61,13.97 | 54.61,13.97 54.61,16.51 | 54.61,16.51 54.61,17.78 | 57.15,15.24 57.15,13.97 | 57.15,13.97 55.88,12.7 | 55.88,12.7 55.88,15.24 | 55.88,15.24 54.61,16.51 | 57.15,13.97 57.15,8.89 55.88,7.62 53.34,7.62 53.34,8.89 54.61,8.89 | 54.61,8.89 55.88,10.16 | 55.88,10.16 55.88,8.89 54.61,8.89 | 54.61,17.78 57.15,17.78 | 57.15,15.24 57.15,16.51 57.15,17.78 | 57.15,15.24 55.88,16.51 | 55.88,16.51 57.15,17.78
N$29
  Bottom 0.254: 0,88.9 0,86.36
N$30
  Bottom 0.254: -1.27,87.63 1.27,87.63
N$31
  Top 0.254: 0,88.9 0,86.36
N$32
  Top 0.254: -1.27,87.63 1.27,87.63
N$33
  Bottom 0.254: 60.96,88.9 60.96,86.36
N$34
  Bottom 0.254: 59.69,87.63 62.23,87.63
N$35
  Top 0.254: 60.96,88.9 60.96,86.36
N$36
  Top 0.254: 59.69,87.63 62.23,87.63
N$37
  Bottom 0.254: 59.69,0 62.23,0
N$38
  Bottom 0.254: 60.96,1.27 60.96,-1.27
N$39
  Top 0.254: 59.69,0 62.23,0
N$40
  Top 0.254: 60.96,1.27 60.96,-1.27
N$41
  Bottom 0.254: 0,1.27 0,-1.27
N$42
  Bottom 0.254: -1.27,0 1.27,0
N$43
  Top 0.254: 0,1.27 0,-1.27
N$44
  Top 0.254: -1.27,0 1.27,0
N$45
  Top 1.422: R1.1 RFID.8 21.59,6.35 25.4,2.54 44.45,2.54 49.53,7.62 57.15,7.62 58.42,8.89 58.42,12.7 57.15,13.97 52.07,13.97 50.8,15.24 50.8,26.67 48.26,29.21 NAPAJANJE.4
  Bottom 1.422: 50.8,77.47 49.53,77.47 | 49.53,77.47 48.26,77.47 | 48.26,77.47 49.53,76.2 | 49.53,76.2 49.53,77.47 | 49.53,77.47 NAPAJANJE.4 | NAPAJANJE.4 NAPAJANJE.2 | 50.8,74.93 50.8,77.47 | NAPAJANJE.2 50.8,77.47 | 49.53,74.93 48.26,74.93 48.26,76.2 | 50.8,74.93 49.53,74.93 | 49.53,74.93 48.26,76.2 | 48.26,76.2 48.26,77.47 | 48.26,77.47 NAPAJANJE.4 | 49.53,76.2 50.8,74.93 | 50.8,74.93 52.07,74.93 | 52.07,74.93 54.61,74.93 | 55.88,76.2 54.61,74.93 | 54.61,74.93 55.88,74.93 57.15,76.2 57.15,77.47 | NAPAJANJE.2 50.8,76.2 52.07,74.93 | 52.07,74.93 52.07,76.2 | 52.07,76.2 52.07,77.47 | 52.07,77.47 52.07,78.74 | 52.07,78.74 54.61,78.74 | 54.61,78.74 55.88,77.47 | 55.88,77.47 55.88,76.2 | 55.88,76.2 54.61,76.2 | 53.34,76.2 52.07,76.2 | 52.07,76.2 53.34,77.47 | 53.34,77.47 54.61,77.47 54.61,76.2 | 54.61,76.2 53.34,76.2 | 53.34,76.2 52.07,77.47 | 52.07,77.47 NAPAJANJE.2 | NAPAJANJE.2 52.07,78.74 | 52.07,78.74 53.34,77.47 | 53.34,77.47 52.07,77.47 | 52.07,77.47 50.8,77.47 | 50.8,77.47 49.53,76.2 | 54.61,78.74 57.15,78.74 | 57.15,78.74 57.15,77.47 | 57.15,78.74 55.88,77.47 | 55.88,77.47 57.15,77.47 | RFID.8 21.59,13.97 | 21.59,13.97 22.86,15.24 | 22.86,15.24 24.13,15.24 | 26.67,19.05 26.67,20.32 25.4,21.59 | 25.4,21.59 24.13,21.59 | 21.59,13.97 21.59,21.59 22.86,21.59 | 22.86,15.24 22.86,16.51 | 22.86,17.78 22.86,21.59 | 22.86,21.59 24.13,21.59 | 24.13,21.59 24.13,15.24 | 25.4,21.59 25.4,20.32 | 25.4,20.32 25.4,17.78 | 25.4,16.51 25.4,15.24 | 25.4,15.24 24.13,15.24 | 24.13,15.24 22.86,16.51 | 22.86,16.51 22.86,17.78 | 22.86,17.78 25.4,20.32 | 25.4,20.32 26.67,19.05 | 26.67,17.78 26.67,19.05 | 25.4,15.24 26.67,15.24 R4.2 | 25.4,17.78 26.67,17.78 | 26.67,17.78 R4.2 | R4.2 25.4,16.51 | 25.4,16.51 25.4,17.78
VCC
  Bottom 1.422: 2.54,53.34 2.54,48.26 | 2.54,48.26 2.54,27.94 | 2.54,26.67 2.54,25.4 | 2.54,24.13 2.54,22.86 | 2.54,21.59 2.54,20.32 | 2.54,19.05 2.54,17.78 | 2.54,16.51 2.54,15.24 | 2.54,13.97 2.54,12.7 | 2.54,11.43 2.54,10.16 | R2.2 21.59,85.09 27.94,85.09 PICKIT_ICD.2 | 26.67,46.99 27.94,46.99 33.02,52.07 | 35.56,52.07 IC1.32 43.18,52.07 | 33.02,52.07 31.75,52.07 27.94,48.26 | 27.94,48.26 26.67,46.99 | 26.67,46.99 25.4,46.99 | 25.4,46.99 IC1.11 21.59,46.99 19.05,49.53 | 25.4,46.99 26.67,48.26 | 26.67,48.26 26.67,49.53 | 26.67,53.34 26.67,71.12 27.94,72.39 PICKIT_ICD.2 | PICKIT_ICD.2 27.94,78.74 29.21,77.47 | 30.48,77.47 31.75,77.47 | 39.37,78.74 NAPAJANJE.8 | 41.91,74.93 36.83,74.93 35.56,73.66 | 35.56,73.66 34.29,72.39 | 34.29,72.39 34.29,55.88 | 34.29,54.61 34.29,53.34 | 34.29,53.34 35.56,52.07 | 35.56,52.07 33.02,52.07 | 33.02,52.07 31.75,53.34 | 29.21,50.8 27.94,49.53 | 27.94,49.53 27.94,52.07 26.67,53.34 | 26.67,49.53 27.94,48.26 | 27.94,48.26 27.94,49.53 | 27.94,49.53 26.67,48.26 | 26.67,49.53 26.67,53.34 | 26.67,53.34 27.94,54.61 | 27.94,54.61 29.21,54.61 | 29.21,54.61 31.75,54.61 | 33.02,54.61 34.29,55.88 | 34.29,55.88 34.29,54.61 | 34.29,54.61 33.02,53.34 31.75,54.61 | 31.75,54.61 33.02,54.61 | 33.02,54.61 34.29,53.34 | 34.29,53.34 31.75,53.34 | 30.48,53.34 29.21,53.34 | 29.21,53.34 29.21,52.07 | 27.94,53.34 29.21,52.07 | 29.21,52.07 30.48,53.34 | 30.48,53.34 30.48,52.07 | 30.48,52.07 29.21,50.8 | 29.21,50.8 29.21,52.07 | 27.94,54.61 29.21,53.34 | 29.21,54.61 29.21,53.34 | 29.21,52.07 30.48,52.07 | 30.48,52.07 31.75,53.34 | 31.75,53.34 30.48,53.34 | 30.48,53.34 27.94,55.88 | 27.94,55.88 27.94,54.61 | 27.94,55.88 27.94,71.12 | 27.94,71.12 29.21,71.12 | 29.21,58.42 29.21,55.88 33.02,55.88 33.02,57.15
  Bottom 1.422: 33.02,69.85 33.02,71.12 34.29,72.39 | 34.29,72.39 33.02,72.39 | 31.75,72.39 30.48,72.39 | 30.48,72.39 29.21,71.12 | 29.21,71.12 29.21,68.58 | 29.21,60.96 29.21,58.42 | 29.21,58.42 30.48,57.15 | 30.48,57.15 33.02,57.15 | 33.02,57.15 33.02,62.23 | 33.02,66.04 33.02,67.31 | 33.02,68.58 33.02,69.85 | 33.02,69.85 31.75,71.12 | 29.21,71.12 30.48,71.12 | 30.48,71.12 31.75,71.12 | 31.75,71.12 33.02,72.39 | 31.75,71.12 30.48,69.85 | 30.48,69.85 29.21,68.58 | 29.21,68.58 29.21,66.04 | 29.21,66.04 29.21,62.23 | 29.21,62.23 29.21,60.96 | 29.21,60.96 30.48,59.69 | 30.48,59.69 31.75,58.42 | 31.75,58.42 30.48,58.42 | 30.48,58.42 30.48,59.69 | 30.48,58.42 30.48,57.15 | 30.48,57.15 31.75,58.42 | 31.75,58.42 31.75,62.23 | 31.75,62.23 29.21,62.23 | 29.21,62.23 30.48,60.96 31.75,62.23 | 31.75,62.23 31.75,63.5 33.02,64.77 | 33.02,64.77 33.02,62.23 | 33.02,62.23 30.48,59.69 | 30.48,59.69 30.48,63.5 | 30.48,63.5 30.48,64.77 | 30.48,64.77 29.21,66.04 | 29.21,66.04 30.48,66.04 | 30.48,66.04 31.75,64.77 | 31.75,64.77 33.02,66.04 | 31.75,64.77 30.48,63.5 | 30.48,66.04 31.75,67.31 | 31.75,67.31 33.02,66.04 | 33.02,66.04 31.75,66.04 | 31.75,66.04 31.75,67.31 | 31.75,67.31 30.48,68.58 | 30.48,67.31 30.48,68.58 | 30.48,68.58 31.75,69.85 | 31.75,69.85 31.75,68.58 | 31.75,68.58 33.02,67.31 | 33.02,67.31 33.02,68.58 | 33.02,68.58 31.75,69.85 | 31.75,68.58 31.75,67.31 | 31.75,66.04 30.48,64.77 | 30.48,66.04 30.48,69.85 | 30.48,66.04 30.48,64.77 | 31.75,58.42 33.02,57.15 | 33.02,64.77 33.02,66.04 | 31.75,69.85 30.48,71.12 | 30.48,69.85 30.48,71.12 | 30.48,71.12 29.21,72.39 | 27.94,71.12 29.21,72.39 | 29.21,72.39 29.21,73.66 | 29.21,77.47 30.48,77.47 | 30.48,77.47 31.75,76.2 | 31.75,76.2 30.48,76.2
  Bottom 1.422: 30.48,76.2 29.21,77.47 | 29.21,77.47 29.21,73.66 | 29.21,73.66 30.48,72.39 | 30.48,72.39 30.48,74.93 | 30.48,76.2 30.48,74.93 | 30.48,74.93 31.75,73.66 | 31.75,73.66 31.75,72.39 | 31.75,72.39 33.02,72.39 | 33.02,72.39 34.29,73.66 | 34.29,73.66 33.02,73.66 | 33.02,73.66 31.75,73.66 | 31.75,73.66 31.75,76.2 | 31.75,77.47 31.75,76.2 | 31.75,76.2 33.02,74.93 | 33.02,74.93 33.02,73.66 | 34.29,73.66 35.56,73.66 | 35.56,73.66 34.29,74.93 | 34.29,74.93 33.02,73.66 | 33.02,74.93 33.02,76.2 | 33.02,76.2 31.75,76.2 | 33.02,76.2 34.29,76.2 | 35.56,76.2 38.1,76.2 39.37,77.47 | 39.37,77.47 38.1,77.47 | 38.1,77.47 35.56,74.93 | 35.56,74.93 34.29,74.93 | 33.02,74.93 34.29,74.93 | 34.29,74.93 35.56,76.2 | 35.56,76.2 34.29,76.2 | 34.29,76.2 33.02,74.93 | 35.56,74.93 38.1,74.93 39.37,76.2 | 40.64,77.47 39.37,77.47 | 41.91,77.47 41.91,76.2 | 41.91,76.2 40.64,76.2 | 39.37,76.2 40.64,76.2 | 40.64,76.2 41.91,77.47 | NAPAJANJE.8 41.91,77.47 | 40.64,77.47 39.37,76.2 | 41.91,76.2 43.18,76.2 | 43.18,76.2 41.91,74.93 | 41.91,74.93 45.72,74.93 45.72,76.2 | 45.72,76.2 45.72,77.47 | 45.72,77.47 44.45,77.47 | 44.45,77.47 43.18,76.2 | NAPAJANJE.8 NAPAJANJE.6 | NAPAJANJE.8 43.18,77.47 | 41.91,76.2 43.18,77.47 | 43.18,77.47 44.45,77.47 | 44.45,77.47 44.45,76.2 | 44.45,76.2 45.72,76.2 | 45.72,77.47 NAPAJANJE.6 | NAPAJANJE.6 44.45,77.47 | 41.91,77.47 43.18,77.47 | 43.18,77.47 44.45,76.2 | 44.45,76.2 43.18,76.2 | 41.91,76.2 40.64,77.47 | 40.64,77.47 41.91,77.47 | 41.91,77.47 43.18,76.2 | 31.75,77.47 36.83,77.47 38.1,78.74 39.37,78.74 | 39.37,78.74 38.1,77.47 | 44.45,52.07 45.72,52.07 | 45.72,52.07 52.07,52.07 | 52.07,52.07 53.34,50.8 | 53.34,50.8 53.34,49.53 | 53.34,48.26 PC.1 | PC.1 52.07,46.99 | 52.07,46.99 48.26,46.99
  Bottom 1.422: 48.26,46.99 43.18,52.07 | 43.18,52.07 44.45,52.07 | 44.45,52.07 48.26,48.26 49.53,48.26 | 52.07,48.26 53.34,48.26 | 53.34,48.26 53.34,49.53 | 53.34,49.53 52.07,50.8 | 52.07,50.8 46.99,50.8 | 46.99,50.8 45.72,52.07 | 46.99,50.8 48.26,49.53 | 48.26,49.53 49.53,48.26 | 49.53,48.26 50.8,48.26 | 50.8,48.26 52.07,49.53 | 52.07,49.53 50.8,49.53 | 48.26,49.53 50.8,49.53 | 50.8,49.53 52.07,48.26 | 52.07,48.26 52.07,49.53 | 52.07,48.26 50.8,48.26 | 49.53,48.26 48.26,46.99 | 6.35,7.62 R1.2 | 11.43,7.62 6.35,7.62 | 6.35,7.62 5.08,8.89 | 52.07,49.53 52.07,50.8 | 52.07,50.8 52.07,52.07 | 52.07,52.07 54.61,52.07 | 54.61,52.07 55.88,52.07 57.15,50.8 57.15,48.26 | 52.07,46.99 52.07,48.26 | 54.61,48.26 55.88,48.26 55.88,50.8 53.34,50.8 | 54.61,48.26 53.34,48.26 | 53.34,49.53 54.61,48.26 | 54.61,48.26 54.61,52.07 | 54.61,52.07 53.34,50.8 | 19.05,52.07 19.05,53.34 17.78,54.61 3.81,54.61 2.54,53.34 | 2.54,53.34 3.81,53.34 | 15.24,53.34 17.78,53.34 19.05,52.07 | 19.05,52.07 19.05,50.8 | 19.05,50.8 19.05,49.53 | 19.05,49.53 17.78,50.8 | 17.78,50.8 7.62,50.8 5.08,48.26 5.08,34.29 | 3.81,34.29 3.81,48.26 | 5.08,49.53 7.62,52.07 17.78,52.07 19.05,50.8 | 19.05,50.8 17.78,50.8 | 17.78,50.8 15.24,53.34 | 15.24,53.34 7.62,53.34 | 7.62,53.34 6.35,53.34 | 6.35,53.34 5.08,53.34 | 5.08,53.34 3.81,53.34 | 3.81,53.34 3.81,52.07 | 3.81,49.53 3.81,52.07 | 3.81,52.07 5.08,53.34 | 5.08,53.34 5.08,52.07 | 5.08,50.8 5.08,49.53 | 3.81,48.26 3.81,49.53 | 3.81,49.53 5.08,50.8 | 7.62,53.34 5.08,50.8 | 6.35,53.34 5.08,52.07 | 5.08,52.07 5.08,50.8 | 5.08,49.53 3.81,48.26 | 3.81,48.26 2.54,48.26 | 2.54,48.26 3.81,49.53 | RF_PREDAJNIK.2 11.43,31.75 | 11.43,31.75 13.97,29.21 15.24,29.21 | 15.24,29.21 16.51,29.21 16.51,15.24
  Bottom 1.422: 16.51,15.24 16.51,13.97 15.24,13.97 13.97,12.7 13.97,10.16 | 13.97,10.16 12.7,11.43 | 13.97,13.97 15.24,15.24 15.24,29.21 | 15.24,29.21 13.97,27.94 | 11.43,30.48 11.43,31.75 | 11.43,31.75 10.16,30.48 | 10.16,30.48 7.62,30.48 | 7.62,30.48 6.35,30.48 | 6.35,30.48 5.08,31.75 5.08,34.29 | 5.08,34.29 3.81,34.29 | 3.81,34.29 3.81,31.75 | 3.81,31.75 5.08,30.48 | 5.08,30.48 5.08,29.21 6.35,29.21 | 7.62,29.21 6.35,29.21 | 6.35,29.21 5.08,30.48 | 5.08,30.48 6.35,30.48 | 6.35,30.48 7.62,29.21 | 7.62,29.21 11.43,29.21 | 11.43,29.21 10.16,30.48 | 10.16,30.48 11.43,30.48 | 11.43,30.48 12.7,29.21 | 12.7,29.21 13.97,27.94 | 13.97,27.94 13.97,13.97 | 13.97,13.97 12.7,12.7 | 12.7,12.7 12.7,13.97 | 12.7,13.97 12.7,15.24 | 12.7,15.24 12.7,29.21 | 12.7,29.21 11.43,29.21 | 11.43,29.21 11.43,27.94 | 11.43,27.94 11.43,26.67 | 11.43,25.4 11.43,24.13 | 11.43,22.86 11.43,21.59 | 11.43,20.32 11.43,19.05 | 11.43,17.78 11.43,16.51 | 11.43,15.24 11.43,13.97 | 11.43,10.16 11.43,8.89 | 11.43,8.89 11.43,7.62 | 11.43,7.62 12.7,7.62 | 12.7,7.62 12.7,8.89 | 12.7,8.89 12.7,11.43 | 12.7,11.43 11.43,12.7 | 11.43,10.16 12.7,8.89 | 12.7,11.43 12.7,12.7 | 12.7,15.24 13.97,15.24 | 16.51,15.24 13.97,15.24 | 13.97,15.24 12.7,13.97 | 12.7,13.97 11.43,15.24 | 11.43,12.7 11.43,11.43 | 11.43,8.89 5.08,8.89 | 5.08,8.89 2.54,10.16 | 2.54,10.16 11.43,10.16 | 11.43,10.16 11.43,11.43 | 11.43,11.43 2.54,11.43 | 2.54,11.43 2.54,12.7 | 2.54,12.7 11.43,12.7 | 11.43,12.7 11.43,13.97 | 11.43,13.97 2.54,13.97 | 2.54,13.97 2.54,15.24 | 2.54,15.24 6.35,15.24 | 6.35,15.24 11.43,15.24 | 11.43,15.24 11.43,16.51 | 11.43,16.51 2.54,16.51 | 2.54,16.51 2.54,17.78 | 2.54,17.78 11.43,17.78 | 11.43,17.78 11.43,19.05 | 11.43,19.05 2.54,19.05
  Bottom 1.422: 2.54,19.05 2.54,20.32 | 2.54,20.32 5.08,20.32 | 5.08,20.32 11.43,20.32 | 11.43,20.32 11.43,21.59 | 11.43,21.59 2.54,21.59 | 2.54,21.59 2.54,22.86 | 2.54,22.86 11.43,22.86 | 11.43,22.86 11.43,24.13 | 11.43,24.13 2.54,24.13 | 2.54,24.13 2.54,25.4 | 2.54,25.4 11.43,25.4 | 11.43,25.4 11.43,26.67 | 11.43,26.67 6.35,26.67 | 6.35,26.67 2.54,26.67 | 2.54,26.67 2.54,27.94 | 2.54,27.94 3.81,27.94 | 11.43,27.94 6.35,27.94 | 6.35,27.94 5.08,27.94 | 5.08,27.94 3.81,27.94 | 3.81,27.94 3.81,29.21 | 3.81,31.75 3.81,29.21 | 3.81,29.21 5.08,27.94 | 5.08,20.32 5.08,27.94 | 5.08,27.94 7.62,30.48 | 7.62,30.48 7.62,27.94 6.35,26.67 | 6.35,26.67 6.35,15.24 | 6.35,7.62 5.08,7.62 | 5.08,7.62 3.81,7.62 2.54,8.89 2.54,10.16 | 2.54,10.16 3.81,8.89 | 5.08,7.62 3.81,8.89 | 3.81,8.89 3.81,25.4 6.35,27.94 | 6.35,27.94 6.35,26.67 | PC.1 55.88,46.99 | 55.88,46.99 57.15,48.26 | 57.15,48.26 57.15,46.99 55.88,46.99 | 12.7,7.62 13.97,7.62 13.97,8.89 | 13.97,8.89 13.97,10.16 | 13.97,10.16 12.7,8.89 | 12.7,8.89 13.97,8.89

### Text on the board
Top: Reset | 1 | Gnd | Vdd | 3.3V | RA5 | RB0 | Vdd | Gnd | Rx | Tx | Data | 3.3V